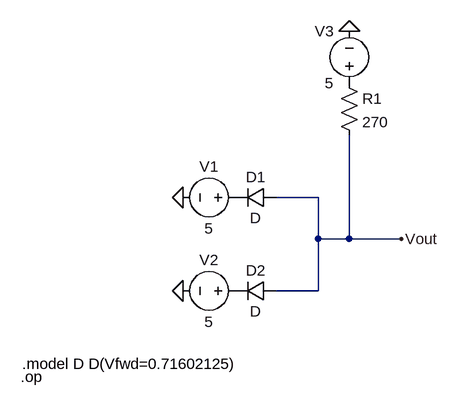
[diagram p0: schematic D3-DÇ2.asc]
D3-DÇ2.asc, the LTspice schematic file:
Version 4
SHEET 1 880 680
WIRE 240 96 176 96
WIRE 240 160 240 96
WIRE 288 160 288 0
WIRE 288 160 240 160
WIRE 368 160 288 160
WIRE 240 240 240 160
WIRE 240 240 176 240
FLAG 368 160 Vout
FLAG 32 96 0
FLAG 32 240 0
FLAG 288 -160 0
SYMBOL res 272 -96 R0
SYMATTR InstName R1
SYMATTR Value 270
SYMBOL voltage 128 96 R90
WINDOW 0 -32 56 VBottom 2
WINDOW 3 32 56 VTop 2
WINDOW 123 0 0 Left 0
WINDOW 39 0 0 Left 0
SYMATTR InstName V1
SYMATTR Value 5
SYMBOL voltage 128 240 R90
WINDOW 0 -32 56 VBottom 2
WINDOW 3 32 56 VTop 2
WINDOW 123 0 0 Left 0
WINDOW 39 0 0 Left 0
SYMATTR InstName V2
SYMATTR Value 5
SYMBOL voltage 288 -64 R180
WINDOW 0 24 96 Left 2
WINDOW 3 24 16 Left 2
WINDOW 123 0 0 Left 0
WINDOW 39 0 0 Left 0
SYMATTR InstName V3
SYMATTR Value 5
SYMBOL diode 176 80 R90
WINDOW 0 0 32 VBottom 2
WINDOW 3 32 32 VTop 2
SYMATTR InstName D1
SYMBOL diode 176 224 R90
WINDOW 0 0 32 VBottom 2
WINDOW 3 32 32 VTop 2
SYMATTR InstName D2
TEXT -216 352 Left 2 !.model D D(Vfwd=0.71602125)
TEXT -218 372 Left 2 !.op

The netlist it stands for:
* D3-DÇ2.asc
R1 P001 Vout 270
V1 P002 0 5
V2 P003 0 5
V3 P001 0 5
D1 Vout P002 D
D2 Vout P003 D
.model D D
.lib standard.dio
.model D D(Vfwd=0.71602125)
.op
.backanno
.end